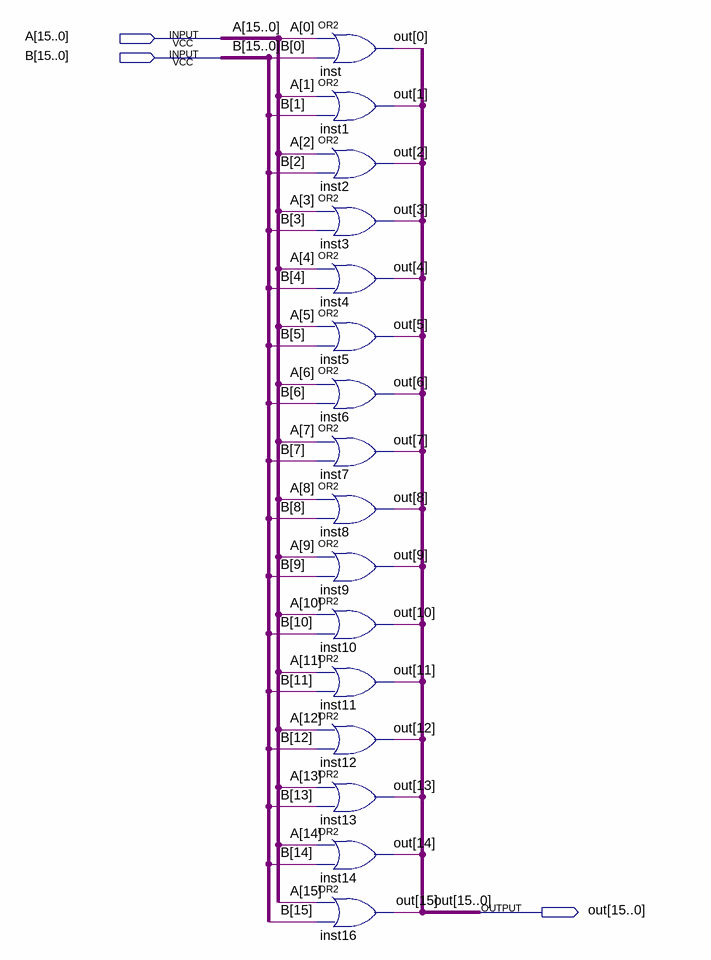
[diagram p0: schematic sheet]
// Quartus schematic 16bit_or.bdf as structural Verilog: 16 symbols, 3 pins
module \16bit_or  (
  input  [15:0] A,
  input  [15:0] B,
  output [15:0] out
);

  or inst (out[0], A[0], B[0]);
  or inst1 (out[1], A[1], B[1]);
  or inst2 (out[2], A[2], B[2]);
  or inst3 (out[3], A[3], B[3]);
  or inst4 (out[4], A[4], B[4]);
  or inst5 (out[5], A[5], B[5]);
  or inst6 (out[6], A[6], B[6]);
  or inst7 (out[7], A[7], B[7]);
  or inst8 (out[8], A[8], B[8]);
  or inst9 (out[9], A[9], B[9]);
  or inst10 (out[10], A[10], B[10]);
  or inst11 (out[11], A[11], B[11]);
  or inst12 (out[12], A[12], B[12]);
  or inst13 (out[13], A[13], B[13]);
  or inst14 (out[14], A[14], B[14]);
  or inst16 (out[15], A[15], B[15]);
endmodule
